# Altium schematic sheet PSU.SchDoc
size A4
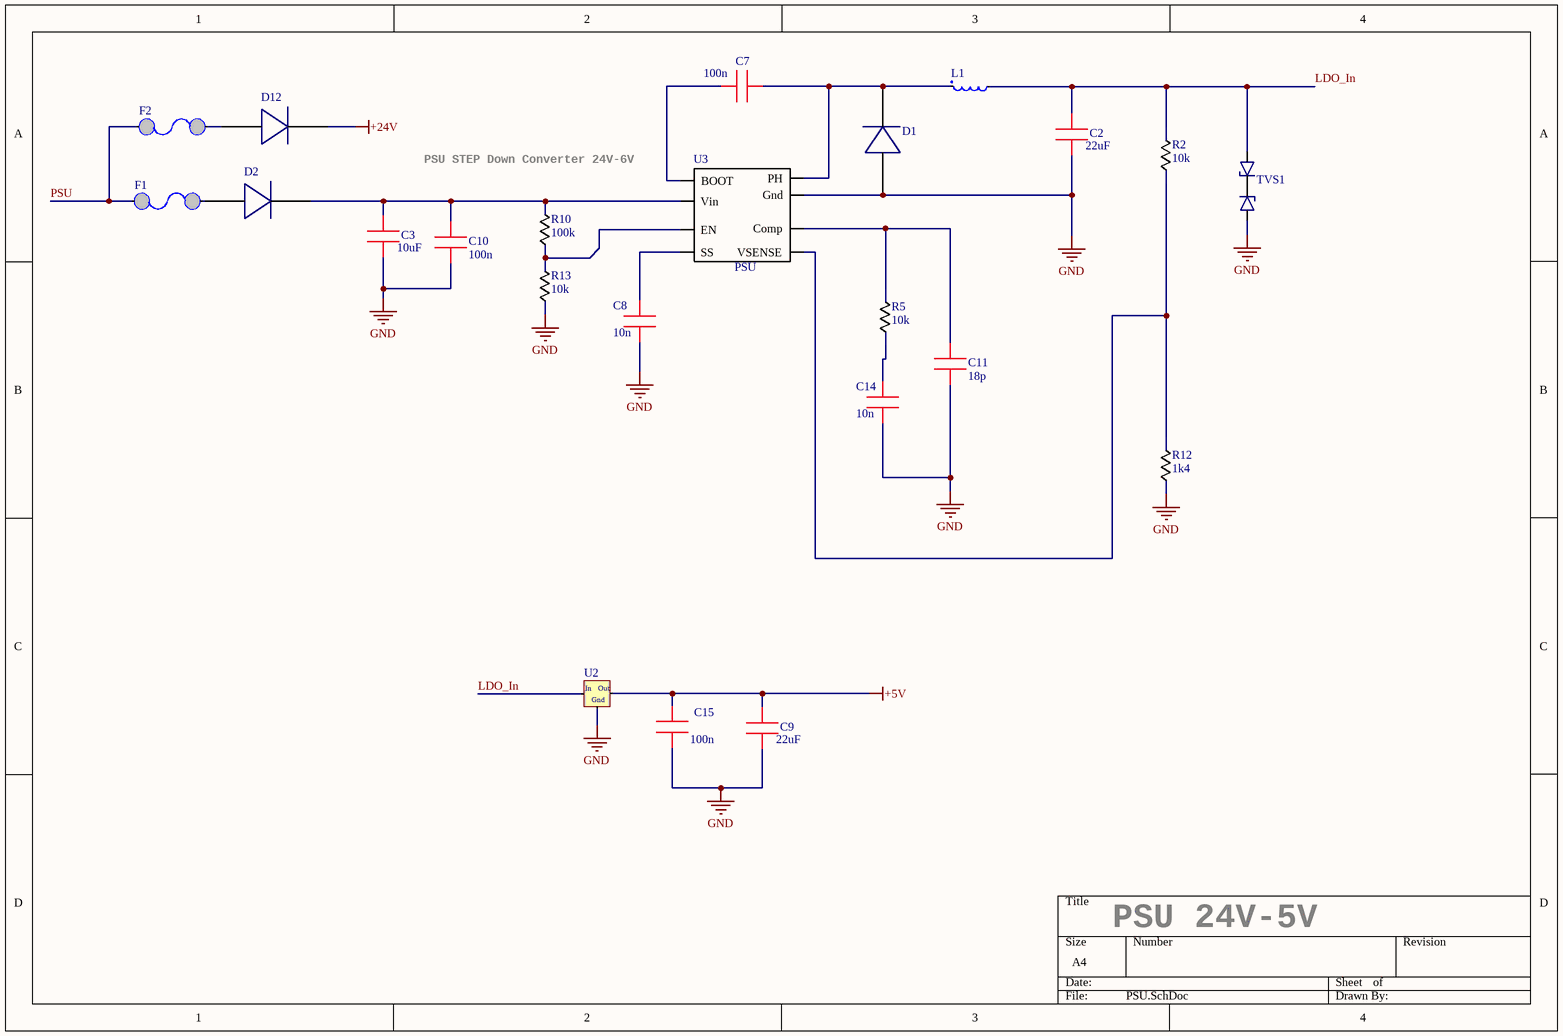
[diagram p0: PSU.SchDoc]

## Parts
C2  22uF  [1206_CAP]
C3  10uF  [1206_CAP]
C7  100n  [0603_Cap]
C8  10n  [0603_Cap]
C9  22uF  [1206_CAP]
C10  100n  [0603_Cap]
C11  18p  [0603_Cap]
C14  10n  [0603_Cap]
C15  100n  [0603_Cap]
D1  (no value)  [B340A-13-F]
D2  (no value)  [B340A-13-F]
D12  (no value)  [B340A-13-F]
F1  (no value)  [Fuse USMF030]
F2  (no value)  [Fuse USMF030]
L1  (no value)  [CDRH127/LDNP-270MC,]
R2  10k  [0603_Res]
R5  10k  [0603_Res]
R10  100k  [0603_Res]
R12  1k4  [0603_Res]
R13  10k  [0603_Res]
TVS1  TVS Diode  [SM6T]  (value not drawn)
U2  (no value)  [SOT223]
U3  PSU  [SOIC 8]

## Nets
+5V: C9.2 C15.1 U2.2(OUT)
+24V: D12.1
GND: C2.1 C3.1 C8.1 C9.1 C10.1 C11.1 C14.1 C15.2 D1.2 R12.1 R13.1 TVS1.1 U2.1(GND) U3.7(Gnd)
LDO_In: C2.2 L1.2 R2.2 TVS1.2 U2.3(IN)
PSU: F1.1 F2.1
NetC3_2: C3.2 C10.2 D2.1 R10.2 U3.2(Vin)
NetC7_1: C7.1 U3.1(BOOT)
NetC7_2: C7.2 D1.1 L1.1 U3.8(PH)
NetC8_2: C8.2 U3.4(SS)
NetC11_2: C11.2 R5.2 U3.6(Comp)
NetC14_2: C14.2 R5.1
NetD2_2: D2.2 F1.0
NetD12_2: D12.2 F2.0
NetR2_1: R2.1 R12.2 U3.5(VSENSE)
NetR10_1: R10.1 R13.2 U3.3(EN)

## Notes on the sheet
- PSU STEP Down Converter 24V-6V
- PSU 24V-5V
- (in symbol NCV1117ST50T3G) In; Out; Gnd

## Library data of the parts
C2 C9 = 0805 Cap: Part Description: Multilayer Ceramic Capacitor 16V 22uF X5R 1206 10%; Part Number: CC1206KKX5R7BB226
C3 = 0805 Cap: Part Description: Capacitors MLCC 50V 10uF X5R 1206 10%; Part Number: CC1206KKX5R9BB106
C7 C10 = 0805 Cap: Part Description: Multilayer Ceramic Capacitor 50 V 0.1uF Y5V 0603 -20/+80%; Part Number: CC0603ZRY5V9BB104
C8 C14 = 0805 Cap: Part Description: Multilayer Ceramic Capacitor 50V 0.01uF Y5V 0603 -20/+80%; Part Number: CC0603ZRY5V9BB103
C11 = 0603 CAP: Part Description: Multilayer Ceramic Capacitor 50 V 18 pF C0G 0603 5%; Part Number: CC0603JRNPO9BN180
C15 = Capasitor 0805: Part Description: Multilayer Ceramic Capacitor 50 V 0.1uF Y5V 0603 -20/+80%; Part Number: CC0603ZRY5V9BB104
D1 = B340A-13-F: Part Description: Schottky Diodes 40V 3A; Part Number: B340A-13-F
D2 = B340A-13-F: Part Number: Schottky Diode 40V 3A; Part Description: B340A-13-F
D12 = B340A-13-F: Part Description: Schottky Diode 40V 3A; Part Number: B340A-13-F
F1 F2 = Fuse PTS: Part Description: Resettable Fuses - PPTC 30V 300MA; Part Number: MF-MSMF030-2
L1 = CDRH127/LDNP-270MC: Part Description: Power Inductors - SMD 22uH 4.7A; Part Number: CDRH127/LDNP-220MC
R2 R5 R13 = Resistor 0805: Part Description: Thin Film Resistors - SMD 10K ohm 1% 1/10W; Part Number: RT0603FRE0710KL
R10 = Resistor 0805: Part Description: Thick Film Resistor - 0603, 100kOhms, 1%, 1/10W; Part Number: RC0603FR-07100KL
R12 = Resistor 0805: Part Description: Thick Film Resistor 0603, 1.4kOhms, 1%, 1/10W; Part Number: RC0603FR-071K4L
TVS1 = SM6T12CA: Part Description: TVS Diodes 600W 12V Bidirect; Part Number: SM6T12CA
U2 = NCV1117ST50T3G: Part Description: LDO 800MA 5V; Part Number: LM1117MPX-5.0
U3 = TPS54331: Part Description: Switching Voltage Regulators 3A 28V; Part Number: TPS54331DR